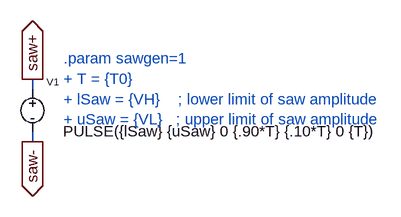
[diagram p0: schematic sawtoothGen.asc]
sawtoothGen.asc, the LTspice schematic file:
Version 4
SHEET 1 1956 680
WIRE 1040 -208 1040 -224
WIRE 1040 -128 1040 -144
FLAG 1040 -224 saw+
IOPIN 1040 -224 Out
FLAG 1040 -128 saw-
IOPIN 1040 -128 Out
SYMBOL MDB_sym\\source-Vmini 1040 -176 R0
WINDOW 3 47 32 Left 2
WINDOW 123 0 0 Left 2
WINDOW 39 0 0 Left 2
SYMATTR Value PULSE({lSaw} {uSaw} 0 {.90*T} {.10*T} 0 {T})
SYMATTR InstName V1
TEXT 1088 -256 Left 2 ;.param sawgen=1\n+ T = {T0} \n+ lSaw = {VH}    ; lower limit of saw amplitude\n+ uSaw = {VL}   ; upper limit of saw amplitude

The netlist it stands for:
* sawtoothGen.asc
V1 saw+ saw- PULSE({lSaw} {uSaw} 0 {.90*T} {.10*T} 0 {T})
* .param sawgen=1
* + T = {T0}
* + lSaw = {VH}    ; lower limit of saw amplitude
* + uSaw = {VL}   ; upper limit of saw amplitude
.backanno
.end